# Altium schematic sheet project1_2023-07-29.schdoc
size 439 x 256 mm
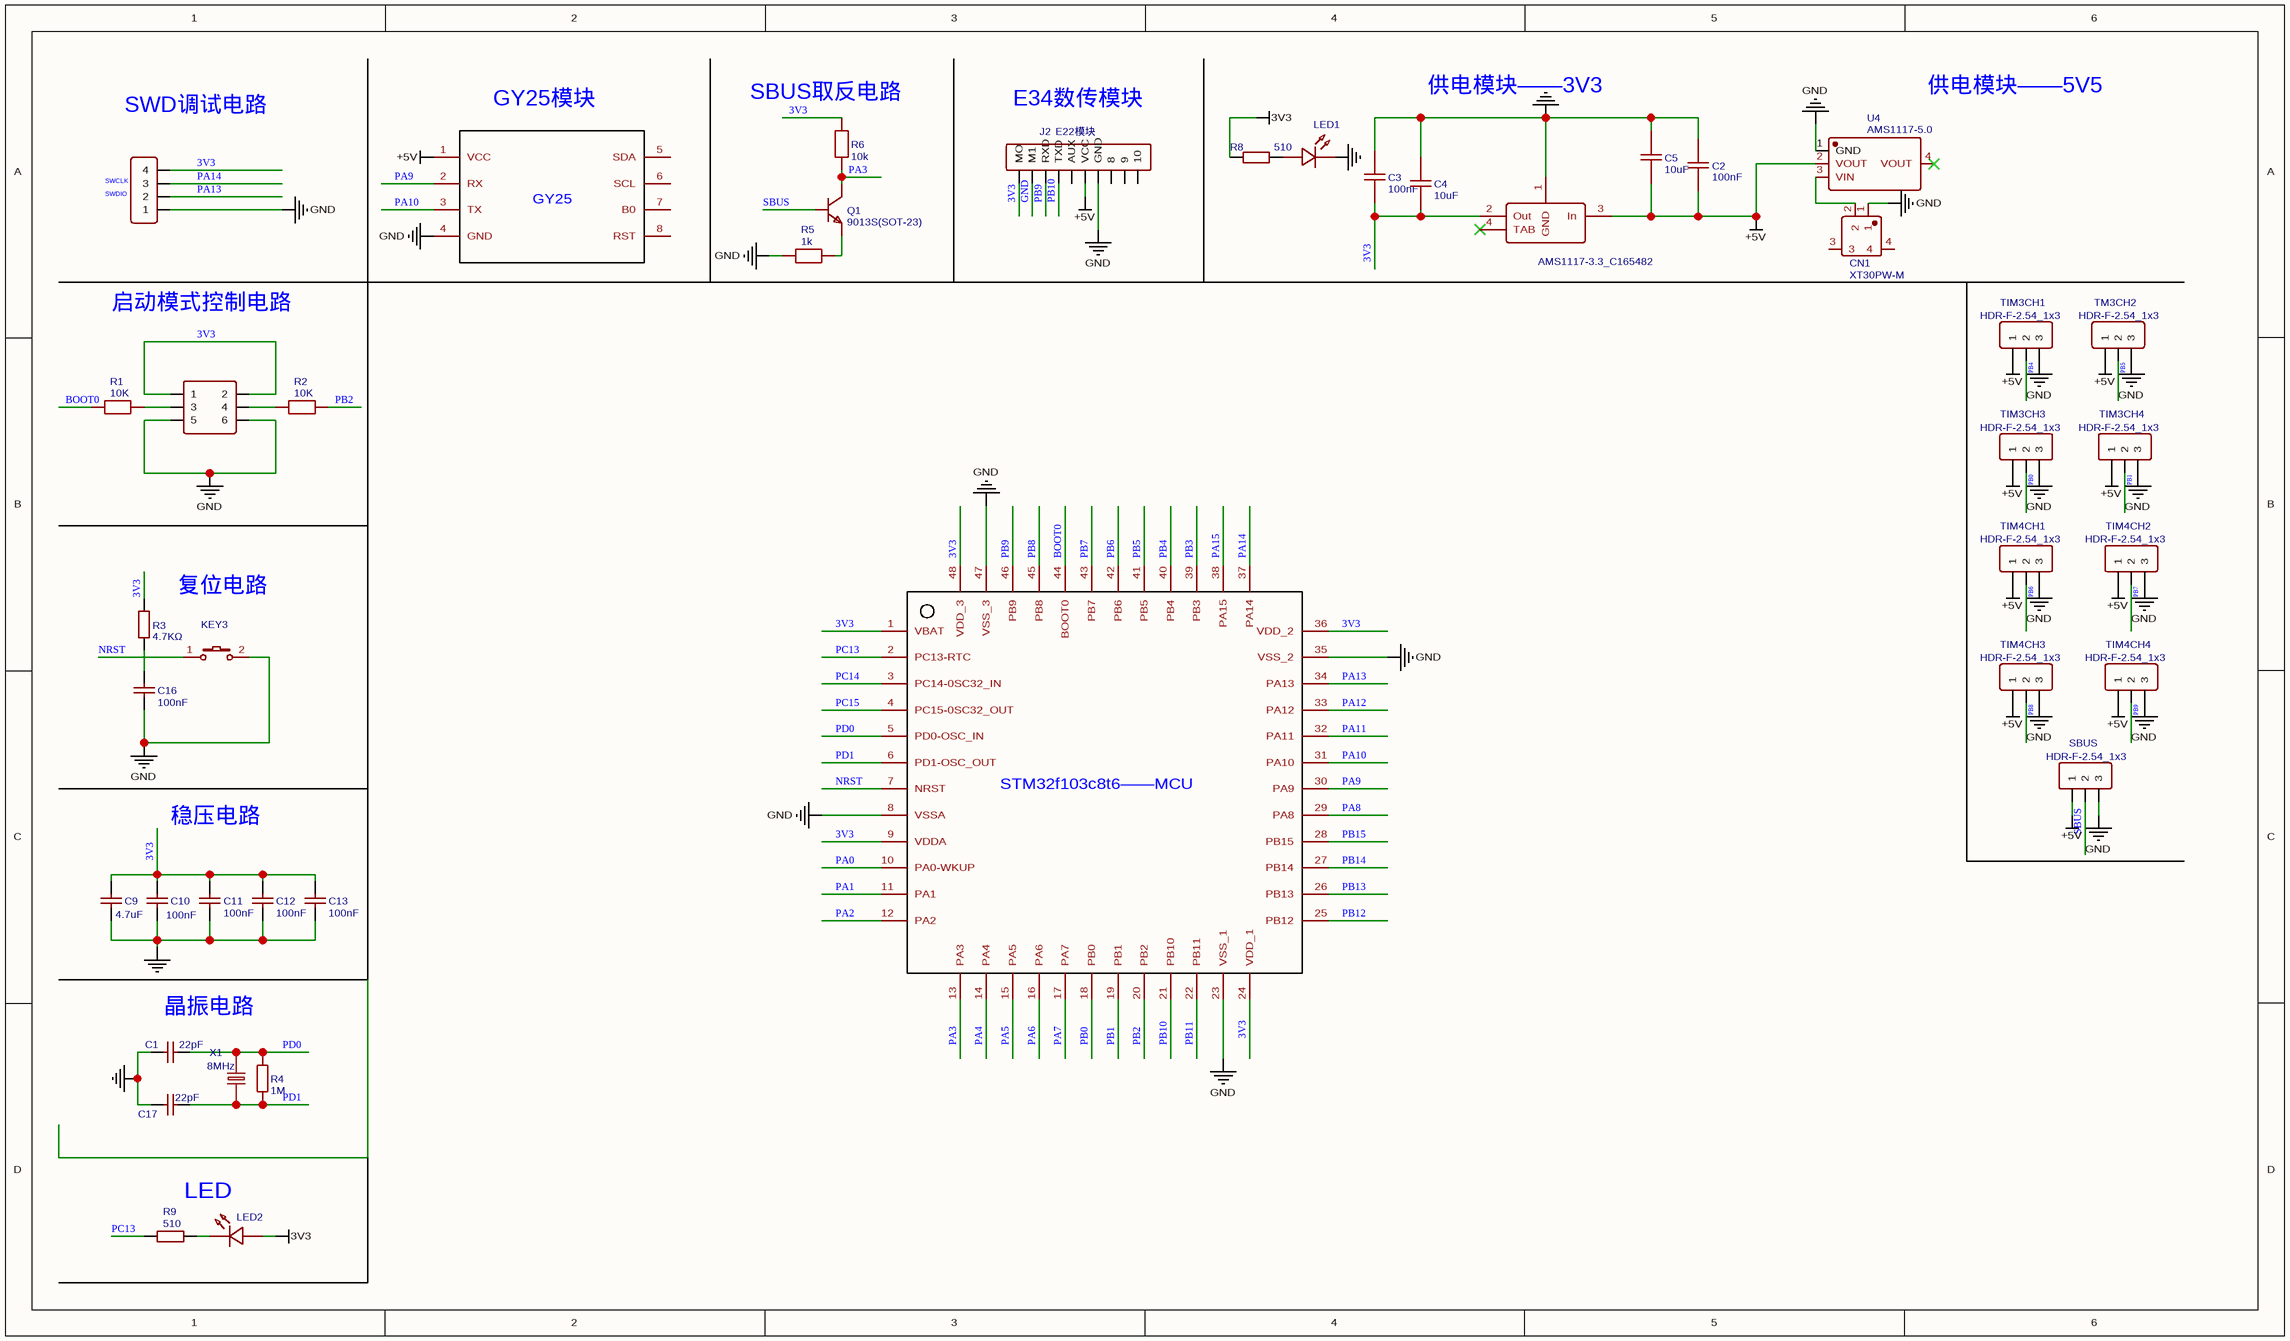
[diagram p0: project1_2023-07-29.schdoc]

## Parts
C1  22pF  [C0603]
C2  100nF  [C0603]
C3  100nF  [C0603]
C4  10uF  [C1206]
C5  10uF  [C1206]
C9  4.7uF  [C0805]
C10  100nF  [C0805]
C11  100nF  [C0805]
C12  100nF  [C0805]
C13  100nF  [C0805]
C16  100nF  [C0805]
C17  22pF  [C0603]
CN1  XT30PW-M  [CONN-TH_XT30PW-M]
J1  HDR-M-2.54_1x4  [HDR-M-2.54_1X4]  (value not drawn)
J2  E22模块  [数传]
KEY3  K2-3.6×6.1_SMD  [KEY-SMD_2P-L6.2-W3.6-LS8.0]  (value not drawn)
LED1  LED-0805_R  [LED0805_RED]  (value not drawn)
LED2  LED-0805_R  [LED0805_RED]  (value not drawn)
P1  HDR-IDC-2.54-2X3P  [IDC-TH_6P-P2.54_C11214]  (value not drawn)
Q1  9013S(SOT-23)  [9013M封装]
R1  10K  [R0805]
R2  10K  [R0805]
R3  4.7KΩ  [R0603]
R4  1M  [R0603]
R5  1k  [R0805]
R6  10k  [R0805]
R8  510  [R0603]
R9  510  [R0603]
SBUS  HDR-F-2.54_1x3  [HDR-F-2.54_1X3]
TIM3CH1  HDR-F-2.54_1x3  [HDR-F-2.54_1X3]
TIM3CH3  HDR-F-2.54_1x3  [HDR-F-2.54_1X3]
TIM3CH4  HDR-F-2.54_1x3  [HDR-F-2.54_1X3]
TIM4CH1  HDR-F-2.54_1x3  [HDR-F-2.54_1X3]
TIM4CH2  HDR-F-2.54_1x3  [HDR-F-2.54_1X3]
TIM4CH3  HDR-F-2.54_1x3  [HDR-F-2.54_1X3]
TIM4CH4  HDR-F-2.54_1x3  [HDR-F-2.54_1X3]
TM3CH2  HDR-F-2.54_1x3  [HDR-F-2.54_1X3]
U1  6t6  [STM32F103C8T6]  (value not drawn)
U2  GY25  [GY25Z]  (value not drawn)
U3  AMS1117-3.3_C165482  [SOT-223_L6.5-W3.5-P2.30-LS7.0-BR]
U4  AMS1117-5.0  [SOT-223_L6.5-W3.5-P2.30-LS7.0-BR]
X1  8MHz  [HC-49S_L11.4-W4.8]

## Nets
3V3: C3.2 C4.2 C9.2 C10.2 C11.2 C12.2 C13.2 J1.4 J2.1(MO) LED2.1 P1.1 P1.2 R3.2 R6.2 R8.2 U1.1(VBAT) U1.9(VDDA) U1.24(VDD_1) U1.36(VDD_2) U1.48(VDD_3) U3.2(Out)
+5V: C2.2 C5.2 J2.6(VCC) SBUS.1 TIM3CH1.1 TIM3CH3.1 TIM3CH4.1 TIM4CH1.1 TIM4CH2.1 TIM4CH3.1 TIM4CH4.1 TM3CH2.1 U2.1(VCC) U3.3(In) U4.2(VOUT)
GND: C1.1 C2.1 C3.1 C4.1 C5.1 C9.1 C10.1 C11.1 C12.1 C13.1 C16.2 C17.1 CN1.1 J1.1 J2.2(M1) J2.7(GND) KEY3.2 LED1.2 P1.5 P1.6 R5.2 SBUS.3 TIM3CH1.3 TIM3CH3.3 TIM3CH4.3 TIM4CH1.3 TIM4CH2.3 TIM4CH3.3 TIM4CH4.3 TM3CH2.3 U1.8(VSSA) U1.23(VSS_1) U1.35(VSS_2) U1.47(VSS_3) U2.4(GND) U3.1(GND) U4.1(GND)
BOOT0: R1.1 U1.44(BOOT0)
NRST: KEY3.1 U1.7(NRST)
PA0: U1.10(PA0-WKUP)
PA1: U1.11(PA1)
PA2: U1.12(PA2)
PA3: Q1.TX1(C) R6.1 U1.13(PA3)
PA4: U1.14(PA4)
PA5: U1.15(PA5)
PA6: U1.16(PA6)
PA7: U1.17(PA7)
PA8: U1.29(PA8)
PA9: U1.30(PA9) U2.2(RX)
PA10: U1.31(PA10) U2.3(TX)
PA11: U1.32(PA11)
PA12: U1.33(PA12)
PA13: J1.2 U1.34(PA13)
PA14: J1.3 U1.37(PA14)
PA15: U1.38(PA15)
PB0: TIM3CH3.2 U1.18(PB0)
PB1: TIM3CH4.2 U1.19(PB1)
PB2: R2.2 U1.20(PB2)
PB3: U1.39(PB3)
PB4: TIM3CH1.2 U1.40(PB4)
PB5: TM3CH2.2 U1.41(PB5)
PB6: TIM4CH1.2 U1.42(PB6)
PB7: TIM4CH2.2 U1.43(PB7)
PB8: TIM4CH3.2 U1.45(PB8)
PB9: J2.3(RXD) TIM4CH4.2 U1.46(PB9)
PB10: J2.4(TXD) U1.21(PB10)
PB11: U1.22(PB11)
PB12: U1.25(PB12)
PB13: U1.26(PB13)
PB14: U1.27(PB14)
PB15: U1.28(PB15)
PC13: R9.1 U1.2(PC13-RTC)
PC14: U1.3(PC14-0SC32_IN)
PC15: U1.4(PC15-0SC32_OUT)
PD0: C1.2 R4.2 U1.5(PD0-OSC_IN) X1.2
PD1: C17.2 R4.1 U1.6(PD1-OSC_OUT) X1.1
SBUS: Q1.GND(B) SBUS.2
NetC16_1: C16.1 R3.1
NetCN1_2: CN1.2 U4.3(VIN)
NetLED1_1: LED1.1 R8.1
NetLED2_2: LED2.2 R9.2
NetP1_3: P1.3 R1.2
NetP1_4: P1.4 R2.1
NetQ1_M1: Q1.M1(E) R5.1

Not connected (* = marked no-connect by the designer): CN1 3 4; J2 5(AUX) 8 9 10; U2 5(SDA) 6(SCL) 7(B0) 8(RST); U3 4(TAB)*; U4 4(VOUT)*

## Notes on the sheet
- (near U2) GY25模块
- (near R6) SBUS取反电路
- E34数传模块
- 供电模块——3V3
- (near U4) 供电模块——5V5
- (near J1) SWD调试电路
- (near J1) SWCLK
- (near J1) SWDIO
- 启动模式控制电路
- (near R3) 复位电路
- 稳压电路
- (near U1) STM32f103c8t6——MCU
- (near C1) 晶振电路
- LED

## Library data of the parts
C1 C17 = 22pF: Manufacturer: YAGEO; Manufacturer Part: CC0603JRNPO9BN220; nameAlias: Capacitance; Supplier: LCSC; Supplier Part: C105620; spicePre: C; spiceSymbolName: CC0603JRNPO9BN220
C2 C3 = 100nF: Manufacturer: SAMSUNG; Manufacturer Part: CL10B104KC8NNNC; nameAlias: Capacitance; SMT Type: Extend; Supplier: LCSC; Supplier Part: C15725; LCSC Assembly: Yes; spicePre: C; spiceSymbolName: CL10B104KC8NNNC
C4 C5 = 10uF: Manufacturer: Taiyo Yuden; Manufacturer Part: EMK316AB7106KL-T; nameAlias: Capacitance; Contributor: LCSC; Supplier: LCSC; Supplier Part: C319199; spicePre: C; spiceSymbolName: EMK316AB7106KL-T
C9 = 4.7uF: Manufacturer: WTC; Manufacturer Part: 0805X475K6R3; nameAlias: Capacitance; Contributor: LCSC; Supplier: LCSC; Supplier Part: C123654; spicePre: C; spiceSymbolName: 0805X475K6R3
C10-C13 C16 = 100nF: Manufacturer Part: CL21B104KBCNNNC; Manufacturer: SAMSUNG; nameAlias: Capacitance; Supplier: LCSC; Supplier Part: C1711; spicePre: C; spiceSymbolName: CL21B104KBCNNNC
CN1 = XT30PW-M: Manufacturer: Changzhou Amass Elec; Contributor: LCSC; Supplier: LCSC; Supplier Part: C431092; Manufacturer Part: XT30PW-M; JLCPCB Part Class: Extended Part; spicePre: C; spiceSymbolName: XT30PW-M
J1 = HDR-M-2.54_1x4: Contributor: LCEDA_Lib; Supplier Part: C124378; Supplier: LCSC; spicePre: J; spiceSymbolName: HDR-M-2.54_1x4
J2 = E22模块: Contributor: cherish11; Supplier Part: C57369; Supplier: LCSC; spicePre: J; spiceSymbolName: E22模块
KEY3 = K2-3.6×6.1_SMD: Manufacturer Part: K2-1107ST-A4SW-06; Contributor: LCEDA_Lib; 制造商: 韩国韩荣; Supplier Part: C118141; Supplier: LCSC; spicePre: K; spiceSymbolName: K2-3.6×6.1_SMD
LED1 LED2 = LED-0805_R: Manufacturer: EVERLIGHT(台湾亿光); Manufacturer Part: 17-21SURC/S530-A3/TR8; Contributor: LCEDA_Lib; Supplier Part: C72037; spicePre: L; spiceSymbolName: LED-0805_R
P1 = HDR-IDC-2.54-2X3P: Manufacturer: BOOMELE; Manufacturer Part: 2X3 2.54mm IDC Box; Supplier: LCSC; image: //image.lceda.cn/szlcsc/C11214.jpg; Supplier Part: C11214; spicePre: P; spiceSymbolName: HDR-IDC-2.54-2X3P
Q1 = 9013S(SOT-23): Manufacturer: KEC; Manufacturer Part: 2n3904S-RTK/PS; Contributor: LCEDA_Lib; Supplier: LCSC; Supplier Part: C18536; Paste Type: SOT-23; spicePre: Q; spiceSymbolName: 2N3904(SOT-23)
R1 R2 = 10K: Manufacturer: Uniroyal Elec; Manufacturer Part: 0805W8F1002T5E; nameAlias: Resistance (Ohms); Contributor: LCSC; SMT Type: Extend; Supplier: LCSC; Supplier Part: C38522; LCSC Assembly: Yes; spicePre: R; spiceSymbolName: 0805W8F1002T5E_C38522
R3 = 4.7KΩ: Manufacturer: UniOhm; Manufacturer Part: 0603WAJ0472T5E; Power: 1/10W; Tolerance: ±5%; Value: 4.7KΩ; Supplier: Partnumber; spicePre: R; spiceSymbolName: 4.7KΩ
R4 = 1M: Manufacturer: Stackpole Elec; Manufacturer Part: RMCF0603FT1M00; nameAlias: Resistance (Ohms); Contributor: LCSC; Supplier: LCSC; Supplier Part: C237111; spicePre: R; spiceSymbolName: RMCF0603FT1M00
R5 = 1k: nameAlias: Value(Ω); Contributor: LCEDA_Lib; spicePre: R; spiceSymbolName: R_0805_EU
R6 = 10k: nameAlias: Value(Ω); Contributor: LCEDA_Lib; spicePre: R; spiceSymbolName: R_0805_EU
R8 R9 = 510: Manufacturer: LIZ; Manufacturer Part: CR0603JA0511G; nameAlias: Resistance (Ohms); Supplier: LCSC; Supplier Part: C101361; spicePre: R; spiceSymbolName: CR0603JA0511G
SBUS TIM3CH1 TIM3CH3 TIM3CH4 TIM4CH1-TIM4CH4 TM3CH2 = HDR-F-2.54_1x3: Contributor: LCEDA_Lib; Supplier Part: C146690; Supplier: LCSC; spicePre: H; spiceSymbolName: HDR-F-2.54_1x3
U1 = 6t6: Contributor: wyj11; Supplier: Digi-Key; spicePre: U; spiceSymbolName: c6t6
U2 = GY25: Contributor: wywy; spicePre: U; spiceSymbolName: GY25Z
U3 = AMS1117-3.3_C165482: Manufacturer: SK; Contributor: LCSC; SMT Type: Extend; Supplier: LCSC; Supplier Part: C165482; Manufacturer Part: AMS1117-3.3; LCSC Assembly: Yes; spicePre: U; spiceSymbolName: AMS1117-3.3_C165482
U4 = AMS1117-5.0: Manufacturer: AMS; sourceId: HltLFyQwq; timeStamp: 1466676067; Supplier: LCSC; Manufacturer Part: AMS1117-5.0; Supplier Part: C6187; JLCPCB Part Class: Basic Part; spicePre: U; spiceSymbolName: AMS1117-5.0
X1 = 8MHz: Manufacturer: Suzhou Liming Elec; Manufacturer Part: 49MD-8.00-20-10-10/A; nameAlias: Frequency; Contributor: LCSC; Supplier: LCSC; Supplier Part: C240996; spicePre: X; spiceSymbolName: 49MD-8.00-20-10-10/A